# EAGLE design RBPZ_Dynamixel TI (EAGLE 9.6.2)
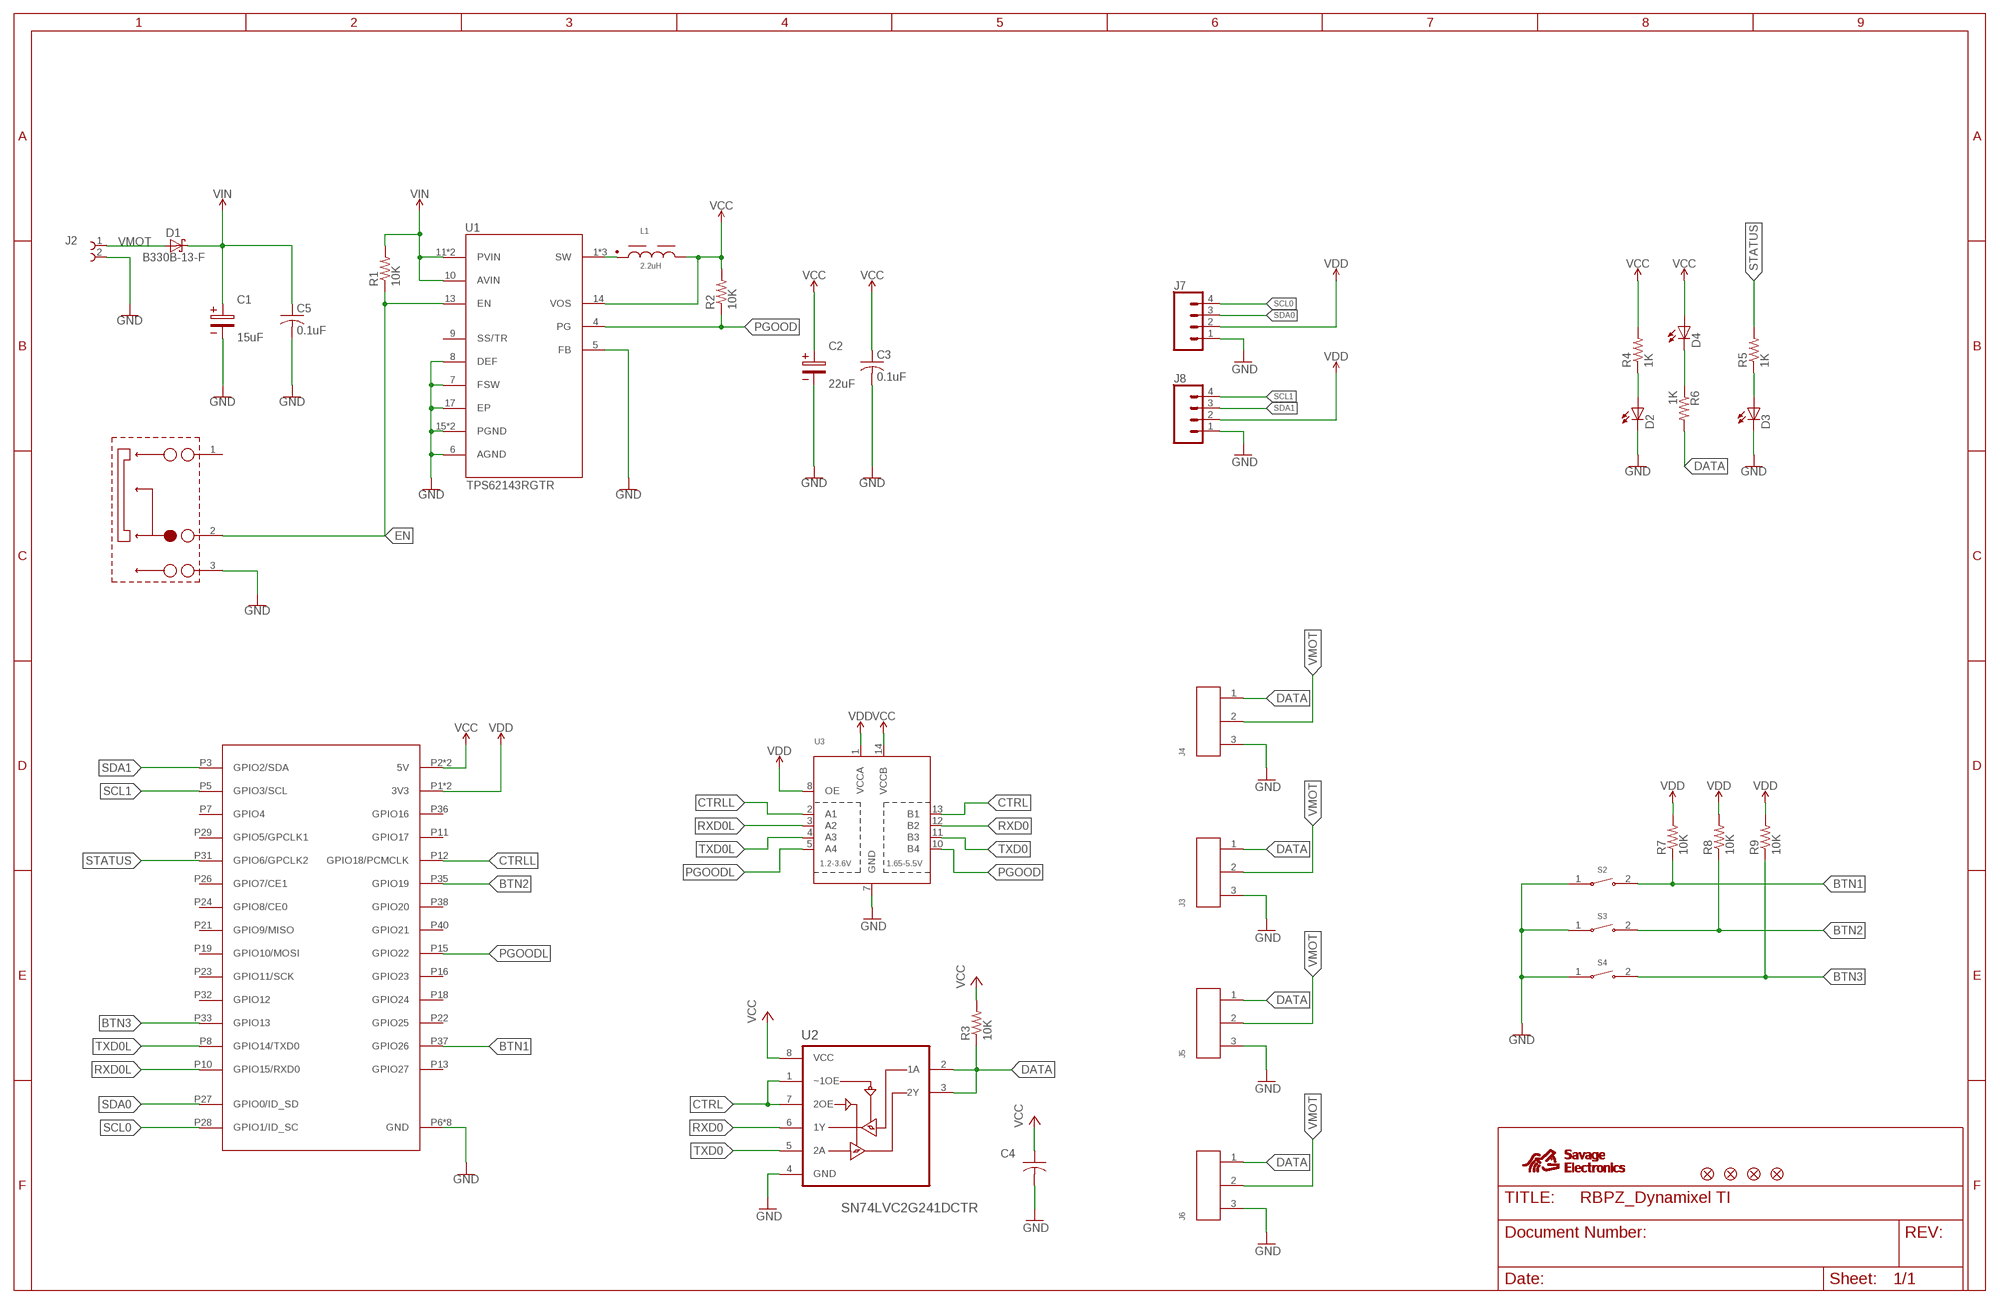
[diagram p0: schematic, sheet 1]

## Parts
C1  15uF  WCAP-ASLI_6,3X5,5_865080643007  [3.5X1.6X2.1(BXCXA)]
C2  22uF  WCAP-ASLI_6,3X5,5_865080643008  [3.5X1.6X2.1(BXCXA)]
C3  0.1uF  C-USC0805  [C0805]
C4  1uF  C-USC0805  [C0805]
C5  0.1uF  C-USC0805  [C0805]
D1  B330B-13-F  [DIONM4336X250N]
D2  LEDCHIP-LED0805  [CHIP-LED0805]
D3  LEDCHIP-LED0805  [CHIP-LED0805]
D4  LEDCHIP-LED0805  [CHIP-LED0805]
FID1  FIDUCIAL""  [FIDUCIAL_1MM]
FID2  FIDUCIAL""  [FIDUCIAL_1MM]
FID3  FIDUCIAL""  [FIDUCIAL_1MM]
FID4  FIDUCIAL""  [FIDUCIAL_1MM]
J1  RBPZERO  [61004021821_RASPBERRYPIZERO]
J2  691137910002  [691137910002]
J3  64600311622  [64600311622]
J4  64600311622  [64600311622]
J5  64600311622  [64600311622]
J6  64600311622  [64600311622]
J7  CONN_04SMD2  [1X04_1MM_RA]
J8  CONN_04SMD2  [1X04_1MM_RA]
L1  2.2uH  WE-LQFS_4818_74406042022  [WE-LQFS_48X8]
R1  10K  R-US_R0805  [R0805]
R2  10K  R-US_R0805  [R0805]
R3  10K  R-US_R0805  [R0805]
R4  1K  R-US_R0805  [R0805]
R5  1K  R-US_R0805  [R0805]
R6  1K  R-US_R0805  [R0805]
R7  10K  R-US_R0805  [R0805]
R8  10K  R-US_R0805  [R0805]
R9  10K  R-US_R0805  [R0805]
S1  450404015514  [450404015514]
S2  434123025826-2PIN  [434123025826-2PIN]
S3  434123025826-2PIN  [434123025826-2PIN]
S4  434123025826-2PIN  [434123025826-2PIN]
U1  TPS62143RGTR  TPS62143  [QFN50P300X300X80-17N]
U2  SN74LVC2G241DCTR  SN74LVC2G241  [SOP65P400X130-8N]
U3  TXB0104PWR  [TSSOP14]

## Nets
BTN1: J1.P37(GPIO26) R7.1 S2.2
BTN2: J1.P35(GPIO19) R8.1 S3.2
BTN3: J1.P33(GPIO13) R9.1 S4.2
CTRL: U2.1(~1OE) U2.7(2OE) U3.13(B1)
CTRLL: J1.P12(GPIO18/PCMCLK) U3.2(A1)
DATA: J3.1 J4.1 J5.1 J6.1 R3.1 R6.2 U2.2(1A) U2.3(2Y)
EN: R1.1 S1.2 U1.13(EN)
GND: C1.2 C2.2 C3.2 C4.2 C5.2 D2.C D3.C J1.P6(GND) J1.P9(GND) J1.P14(GND) J1.P20(GND) J1.P25(GND) J1.P30(GND) J1.P34(GND) J1.P39(GND) J2.2 J3.3 J4.3 J5.3 J6.3 J7.1 J8.1 S1.3 S2.1 S3.1 S4.1 U1.5(FB) U1.6(AGND) U1.7(FSW) U1.8(DEF) U1.15(PGND) U1.16(PGND) U1.17(EP) U2.4(GND) U3.7(GND)
N$1: D4.C R6.1
N$3: D2.A R4.1
N$4: L1.1 U1.1(SW) U1.2(SW) U1.3(SW)
N$5: D3.A R5.1
PGOOD: R2.1 U1.4(PG) U3.10(B4)
PGOODL: J1.P15(GPIO22) U3.5(A4)
RXD0: U2.6(1Y) U3.12(B2)
RXD0L: J1.P10(GPIO15/RXD0) U3.3(A2)
SCL0: J1.P28(GPIO1/ID_SC) J7.4
SCL1: J1.P5(GPIO3/SCL) J8.4
SDA0: J1.P27(GPIO0/ID_SD) J7.3
SDA1: J1.P3(GPIO2/SDA) J8.3
STATUS: J1.P31(GPIO6/GPCLK2) R5.2
TXD0: U2.5(2A) U3.11(B3)
TXD0L: J1.P8(GPIO14/TXD0) U3.4(A3)
VCC: C2.1 C3.1 C4.1 D4.A J1.P2(5V) J1.P4(5V) L1.2 R2.2 R3.2 R4.2 U1.14(VOS) U2.8(VCC) U3.14(VCCB)
VDD: J1.P1(3V3) J1.P17(3V3) J7.2 J8.2 R7.2 R8.2 R9.2 U3.1(VCCA) U3.8(OE)
VIN: C1.1 C5.1 D1.1(C) R1.2 U1.10(AVIN) U1.11(PVIN) U1.12(PVIN)
VMOT: D1.2(A) J2.1 J3.2 J4.2 J5.2 J6.2
Unconnected: J1.P7(GPIO4) J1.P11(GPIO17) J1.P13(GPIO27) J1.P16(GPIO23) J1.P18(GPIO24) J1.P19(GPIO10/MOSI) J1.P21(GPIO9/MISO) J1.P22(GPIO25) J1.P23(GPIO11/SCK) J1.P24(GPIO8/CE0) J1.P26(GPIO7/CE1) J1.P29(GPIO5/GPCLK1) J1.P32(GPIO12) J1.P36(GPIO16) J1.P38(GPIO20) J1.P40(GPIO21) S1.1 U1.9(SS/TR)

## Library data of the parts
C1 = Capacitors (rev18b):WCAP-ASLI: WCAP-ASLI Aluminum Electrolytic Capacitors Characteristics Aluminum Electrolytic Capacitor Recommended soldering: Reflow Operating temperature: -55 °C to +105 °C Low impedance product series Load life:2000 h @ +105 °C Package name and Variant abbreviation: Package: Package: B X C X A = length of the solder pad X width of the solder pad X pitch of the solder pad. <http://katalog.we-online.de/media/images/eisos/WCAP-ASLI_pf2.jpg> Details see: http://katalog.we-online.de/en/pbs/WCAP-ASLI Updated by: Yingchun,Shan Updated: 2017-03-16 2017 (C) Wurth Elektronik; WE-NUMBER: 865080643007/15uF
C2 = Capacitors (rev18b):WCAP-ASLI: WCAP-ASLI Aluminum Electrolytic Capacitors Characteristics Aluminum Electrolytic Capacitor Recommended soldering: Reflow Operating temperature: -55 °C to +105 °C Low impedance product series Load life:2000 h @ +105 °C Package name and Variant abbreviation: Package: Package: B X C X A = length of the solder pad X width of the solder pad X pitch of the solder pad. <http://katalog.we-online.de/media/images/eisos/WCAP-ASLI_pf2.jpg> Details see: http://katalog.we-online.de/en/pbs/WCAP-ASLI Updated by: Yingchun,Shan Updated: 2017-03-16 2017 (C) Wurth Elektronik; WE-NUMBER: 865080643008/22uF
C3-C5 = Adafruit:C-US: CAPACITOR, American symbol
D1 = B330B-13-F:B330B-13-F: Schottky Diode
D2-D4 = Adafruit:LED: LED OSRAM: - CHIPLED LG R971, LG N971, LY N971, LG Q971, LY Q971, LO R971, LY R971 LH N974, LH R974 LS Q976, LO Q976, LY Q976 LO Q996 - Hyper CHIPLED LW Q18S LB Q993, LB Q99A, LB R99A - SideLED LS A670, LO A670, LY A670, LG A670, LP A670 LB A673, LV A673, LT A673, LW A673 LH A674 LY A675 LS A676, LA A676, LO A676, LY A676, LW A676 LS A679, LY A679, LG A679 - Hyper Micro SIDELED® LS Y876, LA Y876, LO Y876, LY Y876 LT Y87S - SmartLED LW L88C, LW L88S LB L89C, LB L89S, LG L890 LS L89K, LO L89K, LY L89K LS L896, LA L896, LO L896, LY L896 - TOPLED LS T670, LO T670, LY T670, LG T670, LP T670 LSG T670, LSP T670, LSY T670, LOP T670, LYG T670 LG T671, LOG T671, LSG T671 LB T673, LV T673, LT T673, LW T673 LH T674 LS T676, LA T676, LO T676, LY T676, LB T676, LH T676, LSB T676, LW T676 LB T67C, LV T67C, LT T67C, LS T67K, LO T67K, LY T67K, LW E67C LS E67B, LA E67B, LO E67B, LY E67B, LB E67C, LV E67C, LT E67C LW T67C LS T679, LY T679, LG T679 LS T770, LO T770, LY T770, LG T770, LP T770 LB T773, LV T773, LT T773, LW T773 LH T774 LS E675, LA E675, LY E675, LS T675 LS T776, LA T776, LO T776, LY T776, LB T776 LHGB T686 LT T68C, LB T68C - Hyper Mini TOPLED® LB M676 - Mini TOPLED Santana® LG M470 LS M47K, LO M47K, LY M47K Source: http://www.osram.convergy.de/
FID1-FID4 = microbuilder:FIDUCIAL: Fiducial Alignment Points Various fiducial points for machine vision alignment.; BOM: EXCLUDE
J1 = RaspberryPi:RBPZERO
J2 = TerminalBlocks (rev19b):691137910002: WR-TBL1 SERIE 1379 - 7.50 MM - HORIZONTAL CABLE ENTRY WITH PRESSURE CLAMP - GLOW WIRE PLASTIC - 2 pins <http://katalog.we-online.de/media/thumbs2/eican/thb_Con-TBL_Screw_PressureClamp_6911379100xx_pf2.jpg> Details see: http://katalog.we-online.de/en/em/TBL_7_50_1379_HORIZONTAL_ENTRY_W_PRESSURE_CLAMP_69113791000x Created on 2015-07-09 2015 (C) Wurth Elektronik
J3-J6 = Wire-to-Board (rev18a):64600311622: WR-WTB 2.50mm Male Shrouded Header, 3 Pins=>Code : WR-WTB_Stiftleiste_m.V_64600311622 <http://katalog.we-online.de/media/thumbs2/eican/thb_WR-WTB_Stiftleiste_m.V_64600711622.jpg> Details see: http://katalog.we-online.de/en/em/WTB_2_50_MALE_SHROUDED_HEADER_6460XX11622 Created 2014-06-05, Karrer Zheng 2014 (C) Würth Elektronik
J7 J8 = SparkFun-Connectors:CONN_04: Multi connection point. Often used as Generic Header-pin footprint for 0.1 inch spaced/style header connections On any of the 0.1 inch spaced packages, you can populate with these: Break Away Headers - Straight <https://www.sparkfun.com/products/116> (PRT-00116) Break Away Male Headers - Right Angle <https://www.sparkfun.com/products/553> (PRT-00553) Female Headers <https://www.sparkfun.com/products/115> (PRT-00115) Break Away Headers - Machine Pin <https://www.sparkfun.com/products/117> (PRT-00117) Break Away Female Headers - Swiss Machine Pin <https://www.sparkfun.com/products/743> (PRT-00743) For SCREWTERMINALS and SPRING TERMINALS visit here: Screw Terimnals on SparkFun.com <https://www.sparkfun.com/search/results?term=Screw+Terminals> (5mm/3.5mm/2.54mm spacing) This device is also useful as a general connection point to wire up your design to another part of your project. Our various solder wires solder well into these plated through hole pads. Hook-Up Wire - Assortment (Stranded, 22 AWG) <https://www.sparkfun.com/products/11375> (PRT-11375) Hook-Up Wire - Assortment (Solid Core, 22 AWG) <https://www.sparkfun.com/products/11367> (PRT-11367) View the entire wire category on our website here <https://www.sparkfun.com/categories/141> Special notes: Molex polarized connector foot print use with SKU : PRT-08231 with associated crimp pins and housings. 1MM SMD Version SKU: PRT-10208; PROD_ID: CONN-10310; SF_ID: PRT-10208
L1 = EMCComponents (rev19b):WE-LQFS_4818: WE-LQFS SMD Semishielded Tiny Power Inductor <http://katalog.we-online.de/media/images/v2/Family_WE-LQFS_3818-4828.jpg> Details see: http://katalog.we-online.de/en/pbs/WE-LQFS Created by Yingchun Shan 2016 (C) Wurth Elektronik; WE-NUMBER: 74406042022/2,2uH
R1-R9 = Adafruit:R-US_: RESISTOR, American symbol
S1 = Eagle_SWITCHES (rev18c):450404015514: WS-SLSU Right angle Slide Switch with boss design Specification Rating 300mA, 12VDC Contact Resistance Initial:70mΩ max. After life test: 200mΩ max. Insulation Resistance: min.100MΩ at 500VDC Dielectric Strength : 250VAC for 1 minute Travel:1.5±0.15mm Operating force :150 ± 75g. Life cycle:10000 steps Switch function : ON-ON. Material Cover : : Stainless Steel Base :PA46 UL 94 HB,COLOR Black Frame :LCP UL 94 V-0, color Black Contact : :Copper Alloy with Silver Terminal : Copper Alloy with Silver <http://katalog.we-online.de/media/images/v2/Family_WS-SLSU_Gruppe.jpg> Details see: http://katalog.we-online.de/en/em/SLSU_6_7X_2_7_SMD_HORIZONTAL 2015 (C) Wurth Elektronik
S2-S4 = Eagle_SWITCHES (rev18c):434123025826-2PIN: 4.2 x 3.2 mm J-Bend SMD Tact Switch WS-TASV MATERIAL PROPERTIES: Cover Material Stainless Steel Actuator Material LCP Actuator Flammability Rating UL94 V-0 Actuator Color White;​ Black Frame Material LCP Frame Flammability Rating UL94 V-0 Frame Color Black Contact Material Stainless Steel Contact Plating Silver Terminal Material Copper Alloy Terminal Plating Silver ELECTRICAL PROPERTIES: Rated Current [1] 50 mA Rated Voltage 16 V (DC) Contact Resistance Initial 500 mΩ Contact Resistance After Life Test 1 Ω Insulation Resistance 100 MΩ Withstanding Voltage 250 V (AC) Bounce 10 ms MECHANICAL PROPERTIES: Operation Force 260 g;​ 160 g Life Cycle 50000 Times;​ 100000 Times GENERAL INFORMATION: Operating Temperature -40 °C up to +85 °C Storage Temperature (in original packaging) -40 °C up to +85 °C PACKAGING PROPERTIES: Packaging Tape and Reel Packaging Unit (Qty.) 2900 <http://katalog.we-online.de/media/images/v2/Family_WS-TASV-4341x30258x6_Gruppe.jpg> Details see: http://katalog.we-online.de/em/datasheet/434123025826.pdf 2017(C) Wurth Elektronik
U1 = TPS62143RGTT:TPS62143; A_MAX: 0.8; B_MAX: 0.3; B_MIN: 0.2; B_NOM: 0.25; D2_NOM: 1.1; D_MAX: 3.0; D_MIN: 3.0; D_NOM: 3.0; E2_NOM: 1.1; ENOM: 0.5; E_MAX: 3.0; E_MIN: 3.0; E_NOM: 3.0; L_MAX: 0.5; L_MIN: 0.3; L_NOM: 0.4; MANUFACTURER: Maxim Integrated; PIN_COUNT_D: 4.0; PIN_COUNT_E: 4.0; SNAPEDA_PACKAGE_ID: 70454; STANDARD: IPC 7351B
U2 = SN74LVC2G241:SN74LVC2G241; AVAILABILITY: Unavailable; DESCRIPTION: Dual Buffer/Driver With 3-State Outputs; MF: Texas Instruments; MP: SN74LVC2G241; PACKAGE: VFSOP-8 Texas Instruments; PRICE: None
U3 = Adafruit:TXB0104PWR: 4-Bit Bi-Directional Level Shifter 1.2V-3.6V (VCCA) to 1.65V-5.5V (VCCB) bi-directional level shifter with auto direction sensing. Max data rate - VCCA 1.8V: 20Mbps (50ns), VCCA 3.3V: 100Mbps (10ns) Digikey: 296-21929-1-ND

## Board
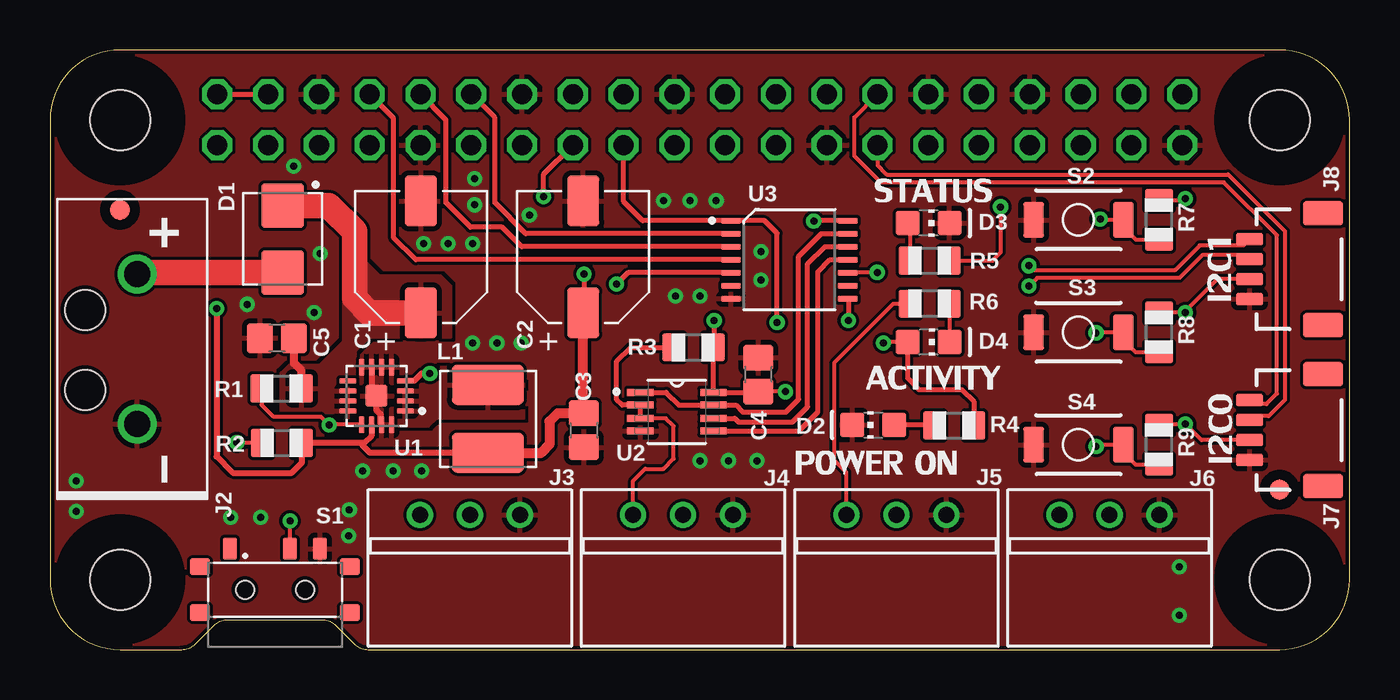
[diagram p1: board, top side]
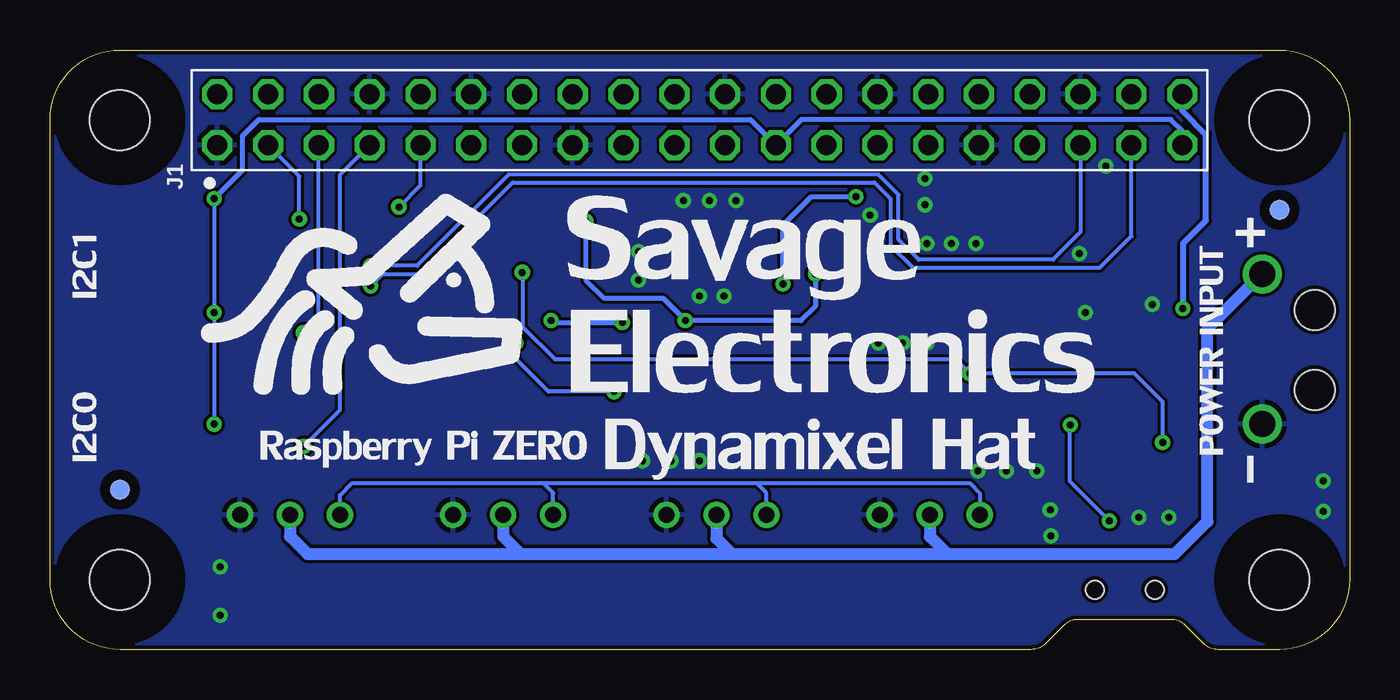
[diagram p2: board, bottom side, seen from below]

Size 65 x 30 mm. Coordinates in mm from the lower left corner, seen from the top.
Outline: 0,26.5 0,3.5 arc90 3.5,0 6.59,0 arc45 7.29,0.29 8.21,1.21 arc-45 8.91,1.5 13.59,1.5 arc-45 14.29,1.21 15.21,0.29 arc45 15.91,0 61.5,0 arc90 65,3.5 65,26.5 arc90 61.5,30 3.5,30 arc90 0,26.5
Copper layers (1*16): Top 0.035mm / dielectric 1.5mm / Bottom 0.035mm
Design rules "default *": minimum track width 6mil, minimum drill 0.35mm, track to track 6mil, track to pad 6mil, pad to pad 6mil, via to via 6mil, smd to smd 6mil, copper to edge 8mil, drill to drill 6mil, minimum pad ring 10mil, minimum via ring 8mil, stop-mask expansion 4mil, vias tented up to drill 15mil, thermal gap 10mil
Holes 2 mm at 1.75,13 1.75,17

### Footprints (pad centres in the part's own frame; a part is rotated, then mirrored left to right if it is on the bottom)
3.5X1.6X2.1(BXCXA) = smd 2.54 x 1.6: 1 2.8,0; 2 -2.8,0
C0805 = smd 1.3 x 1.5: 1 -0.85,0; 2 0.85,0
DIONM4336X250N = smd 2.22 x 2.13: 1 -1.68,0; 2 1.68,0
CHIP-LED0805 = smd 1.2 x 1.2: A 0,-1.05; C 0,1.05
FIDUCIAL_1MM = smd 1 x 1: 1 0,0
61004021821_RASPBERRYPIZERO = drill 1 octagon: P1 56.63,25.241; P2 56.63,27.781; P3 54.09,25.241; P4 54.09,27.781; P5 51.55,25.241; P6 51.55,27.781; P7 49.01,25.241; P8 49.01,27.781; P9 46.47,25.241; P10 46.47,27.781; P11 43.93,25.241; P12 43.93,27.781; P13 41.39,25.241; P14 41.39,27.781; P15 38.85,25.241; P16 38.85,27.781; P17 36.31,25.241; P18 36.31,27.781; P19 33.77,25.241; P20 33.77,27.781; P21 31.23,25.241; P22 31.23,27.781; P23 28.69,25.241; P24 28.69,27.781; P25 26.15,25.241; P26 26.15,27.781; P27 23.61,25.241; P28 23.61,27.781; P29 21.07,25.241; P30 21.07,27.781; P31 18.53,25.241; P32 18.53,27.781; P33 15.99,25.241; P34 15.99,27.781; P35 13.45,25.241; P36 13.45,27.781; P37 10.91,25.241; P38 10.91,27.781; P39 8.37,25.241; P40 8.37,27.781 | hole 3: 3.5,26.499; 61.5,26.499; 3.5,3.499; 61.5,3.499
691137910002 = drill 1.3: 1 -3.75,0; 2 3.75,0
64600311622 = drill 0.8: 1 2.5,0; 2 0,0; 3 -2.5,0
1X04_1MM_RA = smd 0.6 x 1.35: 1 -1.5,0; 2 -0.5,0; 3 0.5,0; 4 1.5,0 | smd 1.2 x 2: NC1 2.8,-3.675; NC2 -2.8,-3.675
WE-LQFS_48X8 = smd 2 x 3.6: 1 -1.7,0; 2 1.7,0
R0805 = smd 1.1 x 1.4: 1 -1,0; 2 1,0
450404015514 = smd 0.7 x 1.1: 1 2.25,-2.05; 2 -0.75,-2.05; 3 -2.25,-2.05 | smd 1 x 0.8: Z1 -3.75,1.15; Z2 3.75,1.15; Z3 3.75,-1.15; Z4 -3.75,-1.15 | hole 0.9: -1.5,0; 1.5,0
434123025826-2PIN = smd 1.05 x 1.8: 1 -2.24,0; 2 2.24,0
QFN50P300X300X80-17N = smd 0.84 x 0.27: 1 -1.435,0.75; 2 -1.435,0.25; 3 -1.435,-0.25; 4 -1.435,-0.75; 9 1.435,-0.75; 10 1.435,-0.25; 11 1.435,0.25; 12 1.435,0.75 | smd 0.27 x 0.84: 5 -0.75,-1.435; 6 -0.25,-1.435; 7 0.25,-1.435; 8 0.75,-1.435; 13 0.75,1.435; 14 0.25,1.435; 15 -0.25,1.435; 16 -0.75,1.435 | smd 1.1 x 1.1: 17 0,0
SOP65P400X130-8N = smd 1.321 x 0.356: 1 -1.829,0.965; 2 -1.829,0.33; 3 -1.829,-0.33; 4 -1.829,-0.965; 5 1.829,-0.965; 6 1.829,-0.33; 7 1.829,0.33; 8 1.829,0.965
TSSOP14 = smd 0.305 x 0.991: 1 -1.95,-2.918; 2 -1.3,-2.918; 3 -0.65,-2.918; 4 0,-2.918; 5 0.65,-2.918; 6 1.3,-2.918; 7 1.95,-2.918; 8 1.95,2.918; 9 1.3,2.918; 10 0.65,2.918; 11 0,2.918; 12 -0.65,2.918; 13 -1.3,2.918; 14 -1.95,2.918

### Placement (x,y rotation side)
C1  18.55,19.65 270 top
C2  26.67,19.65 270 top
C3  26.71,10.97 270 top
C4  35.44,13.76 90 top
C5  11.36,15.58 180 top
D1  11.64,20.54 270 top
D2  41.18,11.24 90 top
D3  43.95,21.34 270 top
D4  43.95,15.39 270 top
FID1  61.5,8 180 top
FID2  3.5,22 180 top
FID3  3.5,22 0 bottom
FID4  61.5,8 0 bottom
J1  65,0 0 bottom
J2  4.36,15.04 270 top
J3  21,6.74 180 top
J4  31.67,6.74 180 top
J5  42.33,6.74 180 top
J6  53,6.74 180 top
J7  60,10.98 90 top
J8  60,19.03 90 top
L1  21.91,11.55 270 top
R1  11.59,13.06 0 top
R2  11.59,10.34 0 top
R3  32.19,15.12 0 top
R4  45.23,11.21 0 top
R5  44.01,19.46 0 top
R6  43.99,17.31 180 top
R7  55.47,21.5 90 top
R8  55.47,15.88 90 top
R9  55.47,10.25 90 top
S1  11.25,3 180 top
S2  51.44,21.5 0 top
S3  51.44,15.88 0 top
S4  51.44,10.25 0 top
U1  16.33,12.69 180 top
U2  31.36,11.9 0 top
U3  36.98,19.51 270 top

### Tracks (layer width: path | path; a pad name or v marks a point on that pad's centre or on a via)
BTN1  (via drill 0.35)
  Top 0.203: R7.1 54.33,20.5 53.68,21.15 S2.2 52.57,21.5 v52.53,21.54
  Bottom 0.203: v52.53,21.54 52.53,23.68 J1.P37
BTN2  (via drill 0.35)
  Top 0.203: R8.1 54.31,14.88 53.68,15.5 S3.2 52.35,15.88 v52.32,15.85
  Bottom 0.203: v52.32,15.85 51.55,16.62 J1.P35
BTN3  (via drill 0.35)
  Top 0.203: R9.1 54.31,9.25 53.68,9.87 S4.2 52.41,10.25 v52.32,10.16
  Bottom 0.203: v52.32,10.16 50.49,11.99 50.49,23.76 J1.P33
CTRL
  Top 0.254: U2.1 30.82,12.86 31.46,12.23 U2.7 34.3,12.23 34.65,11.89 36.8,11.89 37.44,12.52 37.44,19.66 38.59,20.81 U3.13
CTRLL
  Top 0.254: U3.2 23.8,20.81 22.25,22.35 22.25,26.6 J1.P12
DATA
  Top 0.203: R6.2 42.2,17.31 39.22,14.33 39.22,9.48 39.83,8.87 J5.1 | J4.1 29.17,8.44 29.77,9.04 30.68,9.04 31.19,9.55 31.19,11.18 30.8,11.57 U2.3
  Top 0.254: U2.3 U2.2 28.61,12.23 28.35,12.5 28.35,14.43 29.04,15.12 R3.1
  Bottom 0.203: J6.1 50.5,7.72 49.89,8.33 40.34,8.33 | J3.1 18.49,7.82 19,8.33 29.67,8.33 | 40.34,8.33 29.67,8.33 | J4.1 29.17,7.83 29.67,8.33 | J5.1 39.83,7.83 40.34,8.33
EN  (via drill 0.35)
  Top 0.203: U1.13 13.99,11.26 v13.96,11.23 13.56,11.64 11.2,11.64 10.59,12.25 R1.1 | S1.2 v12,6.44 v12.01,6.43
  Bottom 0.203: v13.96,11.23 14.01,11.19 14.01,8.43 v12.01,6.43
GND  (via drill 0.35)
  Top 0.305: U1.15 16.54,11.3 16.54,11.77 16.34,11.97 U1.17 16.09,12.94 U1.7
  other vias: 18.69,20.32 19.91,20.32 21.13,20.32 23.98,21.74 21.13,15.34 22.35,15.34 23.57,15.34 56.49,4.14 56.49,1.72 9.86,17.27 13.21,16.87 35.56,18.49 35.56,19.91 30.68,22.45 32,22.45 33.32,22.45 31.29,17.68 32.51,17.68 15.65,8.94 17.17,8.94 18.59,8.94 14.97,6.99 14.94,5.69 9.04,6.6 1.32,6.91 1.32,8.43 32.51,9.45 33.93,9.45 35.36,9.45 21.23,22.25 21.23,23.57 13.51,19.81 12.19,24.18 10.54,6.6
  pour Top (rank 2): 0,26.5 0,3.5 arc90 3.5,0 61.5,0 arc90 65,3.5 65,26.5 arc90 61.5,30 3.5,30 arc90
  pour Bottom (rank 2): 0,26.5 0,3.5 arc90 3.5,0 61.5,0 arc90 65,3.5 65,26.5 arc90 61.5,30 3.5,30 arc90
N$1
  Top 0.203: D4.C 45.01,17.29 R6.1
N$3
  Top 0.254: R4.1 44.21,11.24 D2.A
N$4
  pour Top: 23.67,11.58 19.3,11.58 18.9,11.18 17.48,11.18 17.48,12.73 17.86,13.11 18.39,13.11 19.41,14.12 23.67,14.12
N$5
  Top 0.203: D3.A 43.01,21.23 R5.1
PGOOD  (via drill 0.35)
  Top 0.203: v41.38,18.87 41.36,18.86 U3.10 | R2.1 9.37,10.34 v9.35,10.36
  Top 0.305: v19,13.82 18.59,13.82 18.22,13.44 U1.4
  Bottom 0.203: v41.38,18.87 41.35,18.87 41.35,16.14 39.74,14.53 19.71,14.53 v19,13.82 10.77,13.82 9.35,12.39 v9.35,10.36
PGOODL  (via drill 0.35)
  Top 0.254: U3.5 28.92,18.86 v28.35,18.29 | v24.69,22.66 24.69,23.78 J1.P15
  Bottom 0.254: v28.35,18.29 28.35,21.23 26.92,22.66 v24.69,22.66
RXD0
  Top 0.254: U2.6 34.25,11.57 34.44,11.38 37.13,11.38 37.9,12.14 37.9,19.3 38.75,20.16 U3.12
RXD0L
  Top 0.254: U3.3 23.59,20.16 22.62,21.13 21.03,21.13 19.81,22.35 19.81,26.5 J1.P10
SCL0
  Top 0.203: J7.4 60.2,12.28 60.84,12.28 61.37,12.8 61.37,20.73 58.73,23.37 41.55,23.37 40.23,24.69 40.23,26.62 J1.P28
SCL1  (via drill 0.35)
  Top 0.203: v48.97,19.2 49.17,19 56.29,19 57.51,20.22 59.7,20.22 J8.4
  Bottom 0.203: J1.P5 13.45,20.89 14.83,19.51 21.54,19.51 22.55,20.52 22.55,22.76 23.57,23.77 42.06,23.77 46.63,19.2 v48.97,19.2
SDA0
  Top 0.203: J1.P27 41.39,24.23 41.84,23.77 58.93,23.77 61.77,20.93 61.77,12.5 60.96,11.69 60.2,11.69 J7.3
SDA1  (via drill 0.35)
  Top 0.203: J8.3 59.8,19.73 57.63,19.73 56.49,18.59 49.38,18.59 v48.97,18.19
  Bottom 0.203: v48.97,18.19 48.36,18.8 46.43,18.8 41.86,23.37 23.77,23.37 22.96,22.55 22.96,20.22 21.84,19.1 12.5,19.1 10.91,20.69 J1.P3
STATUS  (via drill 0.35)
  Top 0.203: v47.55,22.15 47.55,19.87 47.14,19.46 R5.2
  Bottom 0.203: v47.55,22.15 46.47,23.23 J1.P31
TXD0
  Top 0.254: U2.5 37.45,10.93 38.41,11.89 38.41,18.9 39.01,19.51 U3.11
TXD0L
  Top 0.254: U3.4 18.29,19.51 17.17,20.62 17.17,26.6 J1.P8
VCC  (via drill 0.35)
  Top 0.203: v36.78,12.9 C4.1 | D4.A 41.99,15.39 41.95,15.34 v41.68,15.34
  Top 0.254: v26.72,18.8 26.72,16.9 C2.1 | C4.1 35.39,12.86 U2.8 R3.2 33.22,15.16 v33.22,16.46 | U3.14 38.22,21.46 v38.2,21.44 | J1.P2 J1.P4 | R4.2 46.23,12.38 45.62,13 43.48,13 42.91,13.58 D4.A
  Top 0.305: U1.14 16.09,10.7 15.72,10.34 | 15.72,10.34 R2.2 12.6,10.33 12.6,9.35 12.09,8.84 9.14,8.84 8.33,9.65 v8.33,17.07 | 15.72,10.34 15.62,10.24 16.01,9.85 L1.2
  Top 0.508: L1.2 24.58,9.85 24.98,10.25 24.98,11.42 25.39,11.82 C3.1 26.67,11.86 C2.1
  Bottom 0.203: v36.78,12.9 40.05,12.9 41.68,14.53 v41.68,15.34
  Bottom 0.254: v26.72,18.8 26.72,17.17 27.43,16.46 v33.22,16.46 34.34,17.58 37.29,17.58 38.2,18.49 v38.2,21.44
  Bottom 0.305: J1.P2 8.37,26.97 7.18,25.77 7.18,21.47 8.33,20.32 v8.33,17.07
VDD  (via drill 0.35)
  Top 0.203: R9.2 55.49,11.28 v56.79,11.28 57.59,10.48 J7.2 | R8.2 55.48,16.87 v56.79,16.87 56.79,16.94 58.38,18.53 J8.2 | R7.2 56.74,22.5 v56.79,22.55
  Top 0.254: J1.P17 28.69,22.41 29.65,21.46 U3.1 35.74,21.46 36.37,20.83 v36.37,16.36 | U3.8 39.93,17.53 v39.93,16.46
  Bottom 0.203: v56.79,11.28 v56.79,16.87 v56.79,22.55
  Bottom 0.254: v39.93,16.46 39.83,16.36 v36.37,16.36 | v56.79,22.55 55.37,23.98 55.37,25.7 54.56,26.52 29.97,26.52 J1.P17 27.41,26.52 8.94,26.52 8.37,25.95 J1.P1
VIN
  Top 0.406: R1.2 12.59,13.95 12.21,14.32 C5.1
  Top 1.27: D1.1 13.95,22.22 15.24,20.93 15.24,17.58 15.97,16.85 C1.1
  pour Top: 20.02,18.19 20.02,15.65 15.95,15.65 15.24,14.94 15.24,11.58 11.58,11.58 11.58,13.82 11.99,14.22 13.51,14.22 14.71,15.42 14.71,19.08 15.39,19.76 16.46,18.69 19.51,18.69
VMOT
  Top 1.27: J2.1 4.44,18.86 D1.2
  Bottom 0.61: J3.2 21,5.66 20.12,4.78 | 20.12,4.78 8.74,4.78 7.11,6.4 7.11,16.06 4.39,18.79 J2.1 | J6.2 53,5.65 52.12,4.78 41.45,4.78 | 41.45,4.78 30.89,4.78 | 30.89,4.78 20.12,4.78 | J4.2 31.67,5.55 30.89,4.78 | J5.2 42.33,5.66 41.45,4.78